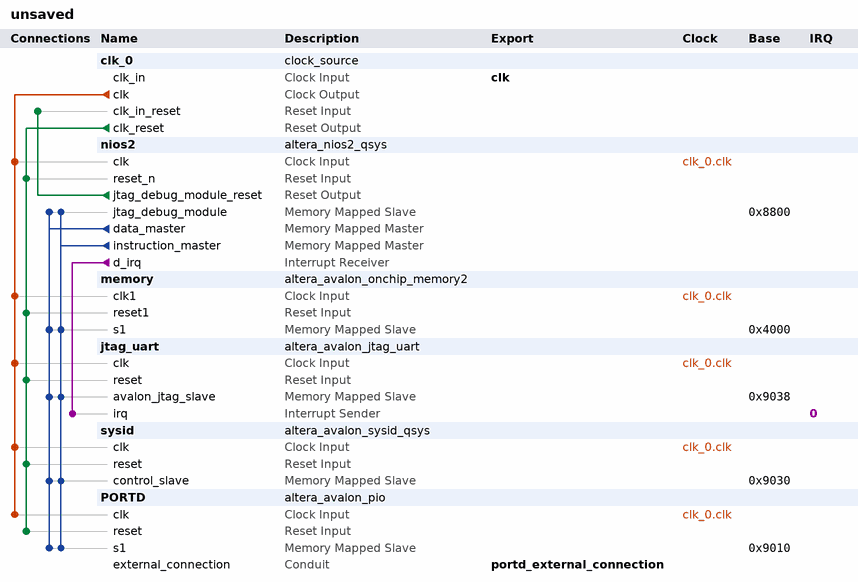
[diagram p0: system contents]
# Platform Designer (Qsys) system unsaved, Cyclone IV E EP4CE22F17C6
# Parameters at their usual value, and those the tool derives, are not listed.
package require -exact qsys 18.1
create_system unsaved
set_project_property DEVICE_FAMILY {Cyclone IV E}
set_project_property DEVICE EP4CE22F17C6

add_instance clk_0 clock_source 18.1
set_instance_parameter_value clk_0 clockFrequency 50000000

add_instance nios2 altera_nios2_qsys 16.1
set_instance_parameter_value nios2 breakSlave nios2.jtag_debug_module
set_instance_parameter_value nios2 exceptionSlave memory.s1
set_instance_parameter_value nios2 icache_size 4096
set_instance_parameter_value nios2 impl Tiny
set_instance_parameter_value nios2 mmu_TLBMissExcSlave None
set_instance_parameter_value nios2 resetSlave memory.s1
set_instance_parameter_value nios2 resetrequest_enabled true

add_instance memory altera_avalon_onchip_memory2 18.1
set_instance_parameter_value memory dataWidth 32
set_instance_parameter_value memory dualPort false
set_instance_parameter_value memory initMemContent true
set_instance_parameter_value memory initializationFileName onchip_mem.hex
set_instance_parameter_value memory memorySize 15000

add_instance jtag_uart altera_avalon_jtag_uart 18.1
set_instance_parameter_value jtag_uart simInteractiveOptions NO_INTERACTIVE_WINDOWS

add_instance sysid altera_avalon_sysid_qsys 18.1
set_instance_parameter_value sysid id 0

add_instance PORTD altera_avalon_pio 18.1
set_instance_parameter_value PORTD direction Output
set_instance_parameter_value PORTD width 8

# connections
add_connection clk_0.clk jtag_uart.clk clock
add_connection clk_0.clk memory.clk1 clock
add_connection clk_0.clk nios2.clk clock
add_connection clk_0.clk PORTD.clk clock
add_connection clk_0.clk sysid.clk clock
add_connection clk_0.clk_reset jtag_uart.reset reset
add_connection clk_0.clk_reset memory.reset1 reset
add_connection clk_0.clk_reset nios2.reset_n reset
add_connection clk_0.clk_reset PORTD.reset reset
add_connection clk_0.clk_reset sysid.reset reset
add_connection nios2.jtag_debug_module_reset clk_0.clk_in_reset reset
add_connection nios2.data_master jtag_uart.avalon_jtag_slave avalon
set_connection_parameter_value nios2.data_master/jtag_uart.avalon_jtag_slave baseAddress 0x9038
add_connection nios2.data_master memory.s1 avalon
set_connection_parameter_value nios2.data_master/memory.s1 baseAddress 0x4000
add_connection nios2.data_master nios2.jtag_debug_module avalon
set_connection_parameter_value nios2.data_master/nios2.jtag_debug_module baseAddress 0x8800
add_connection nios2.data_master PORTD.s1 avalon
set_connection_parameter_value nios2.data_master/PORTD.s1 baseAddress 0x9010
add_connection nios2.data_master sysid.control_slave avalon
set_connection_parameter_value nios2.data_master/sysid.control_slave baseAddress 0x9030
add_connection nios2.instruction_master jtag_uart.avalon_jtag_slave avalon
set_connection_parameter_value nios2.instruction_master/jtag_uart.avalon_jtag_slave baseAddress 0x9038
add_connection nios2.instruction_master memory.s1 avalon
set_connection_parameter_value nios2.instruction_master/memory.s1 baseAddress 0x4000
add_connection nios2.instruction_master nios2.jtag_debug_module avalon
set_connection_parameter_value nios2.instruction_master/nios2.jtag_debug_module baseAddress 0x8800
add_connection nios2.instruction_master PORTD.s1 avalon
set_connection_parameter_value nios2.instruction_master/PORTD.s1 baseAddress 0x9010
add_connection nios2.instruction_master sysid.control_slave avalon
set_connection_parameter_value nios2.instruction_master/sysid.control_slave baseAddress 0x9030
add_connection nios2.d_irq jtag_uart.irq interrupt
set_connection_parameter_value nios2.d_irq/jtag_uart.irq irqNumber 0

# exported interfaces
add_interface clk clock sink
set_interface_property clk EXPORT_OF clk_0.clk_in
add_interface portd_external_connection conduit end
set_interface_property portd_external_connection EXPORT_OF PORTD.external_connection

set_interconnect_requirement {$system} qsys_mm.clockCrossingAdapter HANDSHAKE
set_interconnect_requirement {$system} qsys_mm.enableEccProtection FALSE
set_interconnect_requirement {$system} qsys_mm.insertDefaultSlave FALSE
set_interconnect_requirement {$system} qsys_mm.maxAdditionalLatency 1

save_system unsaved.qsys
